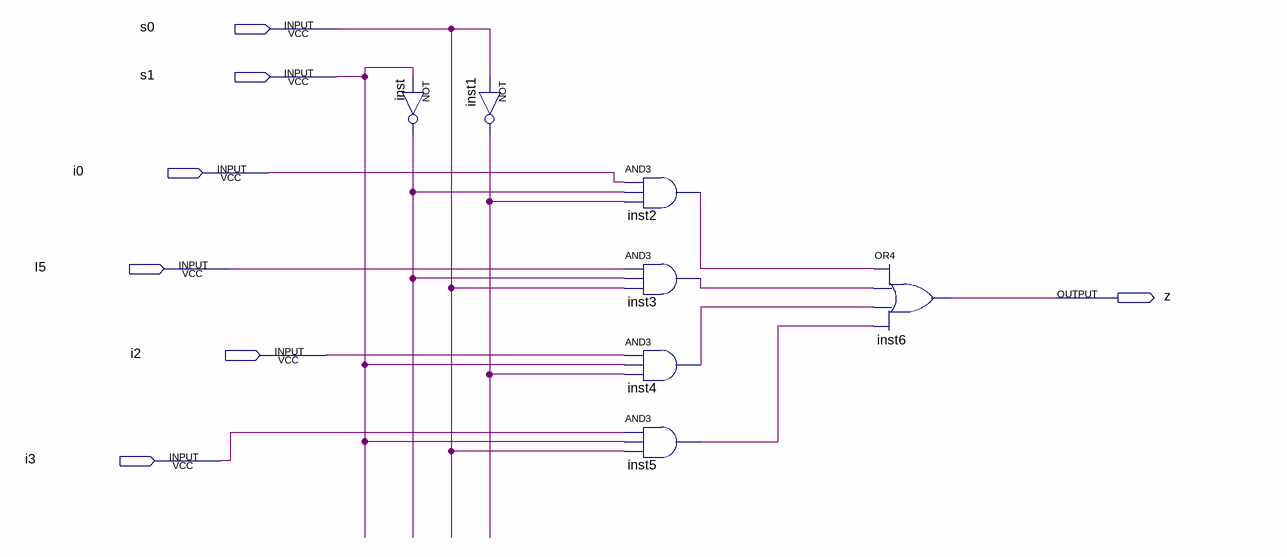
[diagram p0: schematic sheet]
// Quartus schematic EX05_03.bdf as structural Verilog: 7 symbols, 7 pins
module EX05_03 (
  input  s0,
  input  s1,
  input  i0,
  input  I5,
  input  i2,
  input  i3,
  output z
);

  wire inst1_out, inst2_out, inst3_out, inst4_out, inst5_out, inst_out;

  not inst (inst_out, s1);
  not inst1 (inst1_out, s0);
  and inst2 (inst2_out, i0, inst_out, inst1_out);
  and inst3 (inst3_out, I5, inst_out, s0);
  and inst4 (inst4_out, i2, s1, inst1_out);
  and inst5 (inst5_out, i3, s1, s0);
  or inst6 (z, inst2_out, inst3_out, inst4_out, inst5_out);
endmodule
